# EAGLE schematic LEDBlink (EAGLE 9.2.2)
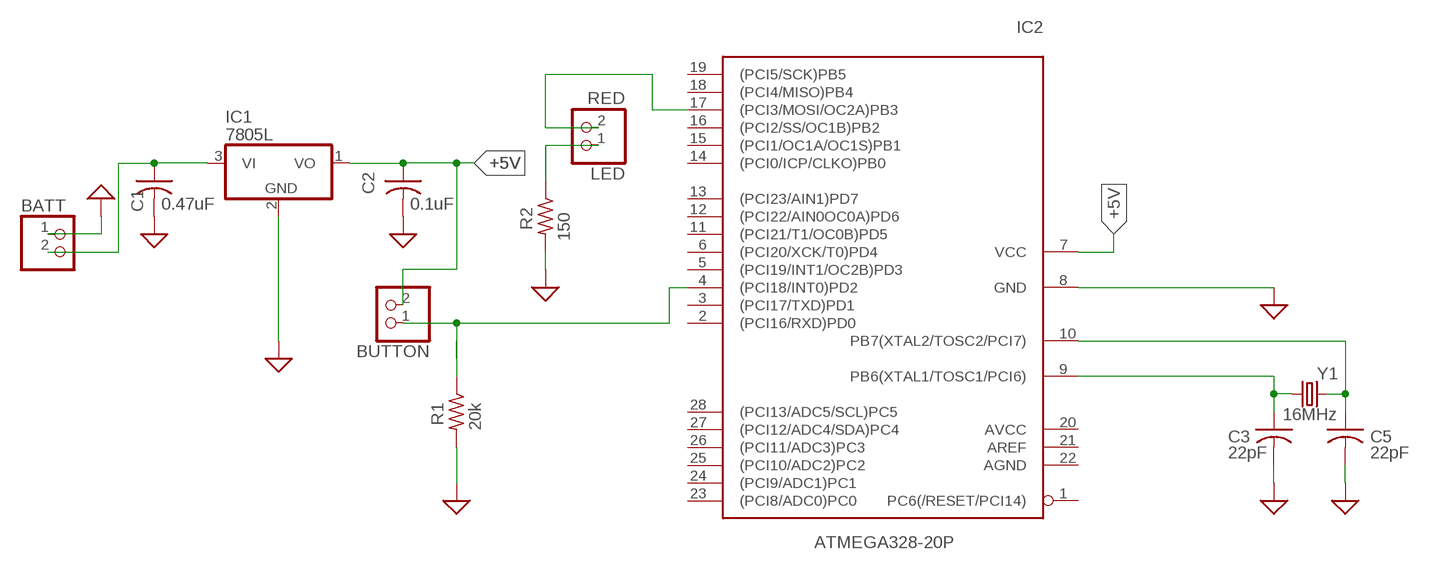
[diagram p0: schematic, sheet 1]

## Parts
BATT  PINHD-1X2/90  [1X02/90]
BUTTON  PINHD-1X2/90  [1X02/90]
C1  0.47uF  C-USC0805  [C0805]
C2  0.1uF  C-USC0805  [C0805]
C3  22pF  C-USC0805  [C0805]
C5  22pF  C-USC0805  [C0805]
IC1  7805L  [TO92]
IC2  ATMEGA328-20P  [DIL28-3]
LED  RED  PINHD-1X2/90  [1X02/90]
R1  20k  R-US_R0805  [R0805]
R2  150  R-US_R0805  [R0805]
Y1  16MHz  CRYSTAL-16MHZPTH-HC49US  [HC49US]

## Nets
+5V: BUTTON.2 C2.1 IC1.1(VO) IC2.7(VCC)
BATT: BATT.2 C1.1 IC1.3(VI)
GND: BATT.1 C1.2 C2.2 C3.2 C5.2 IC1.2(GND) IC2.8(GND) R1.2 R2.2 ; supply symbol labelled SUP
N$1: C3.1 IC2.9(PB6(XTAL1/TOSC1/PCI6)) Y1.1
N$3: LED.1 R2.1
N$10: C5.1 IC2.10(PB7(XTAL2/TOSC2/PCI7)) Y1.2
PWM_PIN: IC2.17((PCI3/MOSI/OC2A)PB3) LED.2
SWN: BUTTON.1 IC2.4((PCI18/INT0)PD2) R1.1
Unconnected: IC2.1(PC6(/RESET/PCI14)) IC2.2((PCI16/RXD)PD0) IC2.3((PCI17/TXD)PD1) IC2.5((PCI19/INT1/OC2B)PD3) IC2.6((PCI20/XCK/T0)PD4) IC2.11((PCI21/T1/OC0B)PD5) IC2.12((PCI22/AIN0OC0A)PD6) IC2.13((PCI23/AIN1)PD7) IC2.14((PCI0/ICP/CLKO)PB0) IC2.15((PCI1/OC1A/OC1S)PB1) IC2.16((PCI2/SS/OC1B)PB2) IC2.18((PCI4/MISO)PB4) IC2.19((PCI5/SCK)PB5) IC2.20(AVCC) IC2.21(AREF) IC2.22(AGND) IC2.23((PCI8/ADC0)PC0) IC2.24((PCI9/ADC1)PC1) IC2.25((PCI10/ADC2)PC2) IC2.26((PCI11/ADC3)PC3) IC2.27((PCI12/ADC4/SDA)PC4) IC2.28((PCI13/ADC5/SCL)PC5)

## Library data of the parts
BATT BUTTON LED = pinhead:PINHD-1X2: PIN HEADER
C1-C3 C5 = adafruit:C-US: CAPACITOR, American symbol
IC1 = adafruit:78*: Positive VOLTAGE REGULATOR Added bigger pads to the TO-92 package
IC2 = atmega328:ATMEGA328*P: MICROCONTROLLER 32 kBytes FLASH 2 kBytes SRAM 1 kBytes EEPROM USART 8-channel 10 bit ADC
R1 R2 = adafruit:R-US_: RESISTOR, American symbol
Y1 = SparkFun-Clocks:CRYSTAL-16MHZ: 16MHz Crystal Digikey Example <http://www.digikey.com/product-search/en?keywords=535-9122-1-ND> Frequency: 16MHz Frequency Stability: ±50ppm Frequency Tolerance: ±20ppm Load Capacitance: 18pF SparkFun Products: Pro Micro -5V/16MHz <https://www.sparkfun.com/products/12640> SparkFun Serial Enabled LCD Kit <https://www.sparkfun.com/products/10097>; PROD_ID: XTAL-08181; SF_ID: COM-00536

## Net classes
0 default: width 0.305 mm, drill 0.508 mm, clearance 0.254 mm